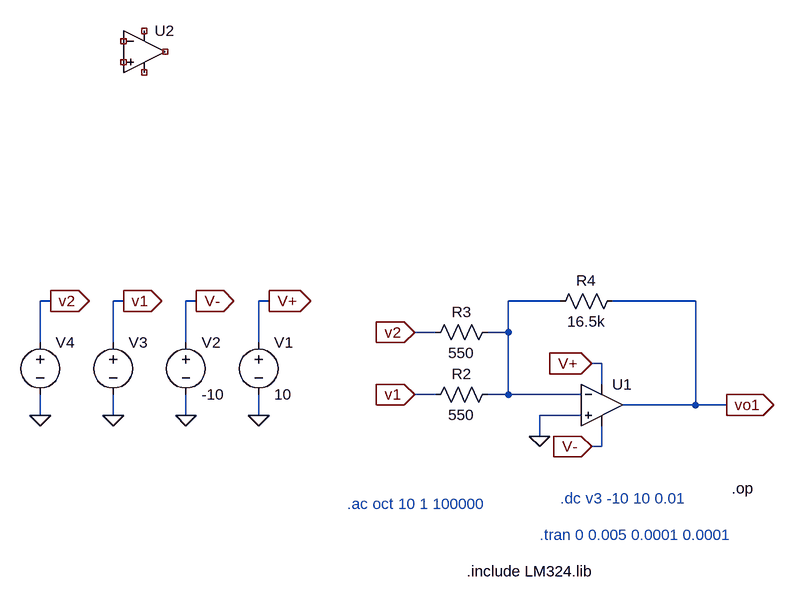
[diagram p0: schematic TP2_C1.asc]
TP2_C1.asc, the LTspice schematic file:
Version 4.1
SHEET 1 880 680
WIRE -624 32 -640 32
WIRE -512 32 -528 32
WIRE -400 32 -416 32
WIRE -288 32 -304 32
WIRE 160 32 80 32
WIRE 368 32 240 32
WIRE -32 80 -64 80
WIRE 80 80 80 32
WIRE 80 80 48 80
WIRE -640 96 -640 32
WIRE -528 96 -528 32
WIRE -416 96 -416 32
WIRE -304 96 -304 32
WIRE 224 128 208 128
WIRE 224 160 224 128
WIRE -32 176 -64 176
WIRE 80 176 80 80
WIRE 80 176 48 176
WIRE 192 176 80 176
WIRE 368 192 368 32
WIRE 368 192 256 192
WIRE 416 192 368 192
WIRE -640 208 -640 176
WIRE -528 208 -528 176
WIRE -416 208 -416 176
WIRE -304 208 -304 176
WIRE 192 208 128 208
WIRE 128 240 128 208
WIRE 224 256 224 224
WIRE 224 256 208 256
FLAG -288 32 V+
IOPIN -288 32 Out
FLAG -304 208 0
FLAG -400 32 V-
IOPIN -400 32 Out
FLAG -416 208 0
FLAG -512 32 v1
IOPIN -512 32 Out
FLAG -528 208 0
FLAG -624 32 v2
IOPIN -624 32 Out
FLAG -640 208 0
FLAG 416 192 vo1
IOPIN 416 192 Out
FLAG -64 176 v1
IOPIN -64 176 In
FLAG 208 128 V+
IOPIN 208 128 In
FLAG 208 256 V-
IOPIN 208 256 In
FLAG -64 80 v2
IOPIN -64 80 In
FLAG 128 240 0
SYMBOL voltage -304 80 R0
WINDOW 123 0 0 Left 0
WINDOW 39 0 0 Left 0
SYMATTR InstName V1
SYMATTR Value 10
SYMBOL voltage -416 80 R0
WINDOW 123 0 0 Left 0
WINDOW 39 0 0 Left 0
SYMATTR InstName V2
SYMATTR Value -10
SYMBOL voltage -528 80 R0
WINDOW 123 24 44 Left 2
WINDOW 39 0 0 Left 0
WINDOW 3 24 72 Left 2
SYMATTR InstName V3
SYMATTR Value ""
SYMBOL voltage -640 80 R0
WINDOW 3 20 95 Left 2
WINDOW 123 19 126 Left 2
WINDOW 39 0 0 Left 0
SYMATTR Value ""
SYMATTR InstName V4
SYMBOL res 64 160 R90
WINDOW 0 0 56 VBottom 2
WINDOW 3 32 56 VTop 2
SYMATTR InstName R2
SYMATTR Value 550
SYMBOL res 64 64 R90
WINDOW 0 0 56 VBottom 2
WINDOW 3 32 56 VTop 2
SYMATTR InstName R3
SYMATTR Value 550
SYMBOL res 256 16 R90
WINDOW 0 0 56 VBottom 2
WINDOW 3 32 56 VTop 2
SYMATTR InstName R4
SYMATTR Value 16.5k
SYMBOL OpAmps\\UniversalOpAmp2 -480 -352 R0
SYMATTR InstName U2
SYMBOL OpAmps\\UniversalOpAmp2 224 192 R0
SYMATTR InstName U1
SYMATTR Value2 Avol=100k GBW=1Meg Slew=10Meg
TEXT -168 344 Left 2 ;.ac oct 10 1 100000
TEXT 160 336 Left 2 ;.dc v3 -10 10 0.01
TEXT 16 448 Left 2 !.include LM324.lib
TEXT 128 392 Left 2 ;.tran 0 0.005 0.0001 0.0001
TEXT 424 320 Left 2 !.op

The netlist it stands for:
* TP2_C1.asc
V1 V+ 0 10
V2 V- 0 -10
V3 v1 0
V4 v2 0
R2 N001 v1 550
R3 N001 v2 550
R4 vo1 N001 16.5k
X§U2 NC_01 NC_02 NC_03 NC_04 NC_05 level2 Avol=1Meg GBW=10Meg Slew=10Meg Ilimit=25m Rail=0 Vos=0 En=0 Enk=0 In=0 Ink=0 Rin=500Meg  ; pins In+ In- V+ V- OUT
X§U1 0 N001 V+ V- vo1 level2 Avol=100k GBW=1Meg Slew=10Meg Ilimit=25m Rail=0 Vos=0 En=0 Enk=0 In=0 Ink=0 Rin=500Meg  ; pins In+ In- V+ V- OUT
* .ac oct 10 1 100000
* .dc v3 -10 10 0.01
.include LM324.lib
* .tran 0 0.005 0.0001 0.0001
.op
.lib UniversalOpAmp2.lib
.backanno
.end